# EAGLE schematic Arduino_MEGA2560_ref (EAGLE 9.6.2)
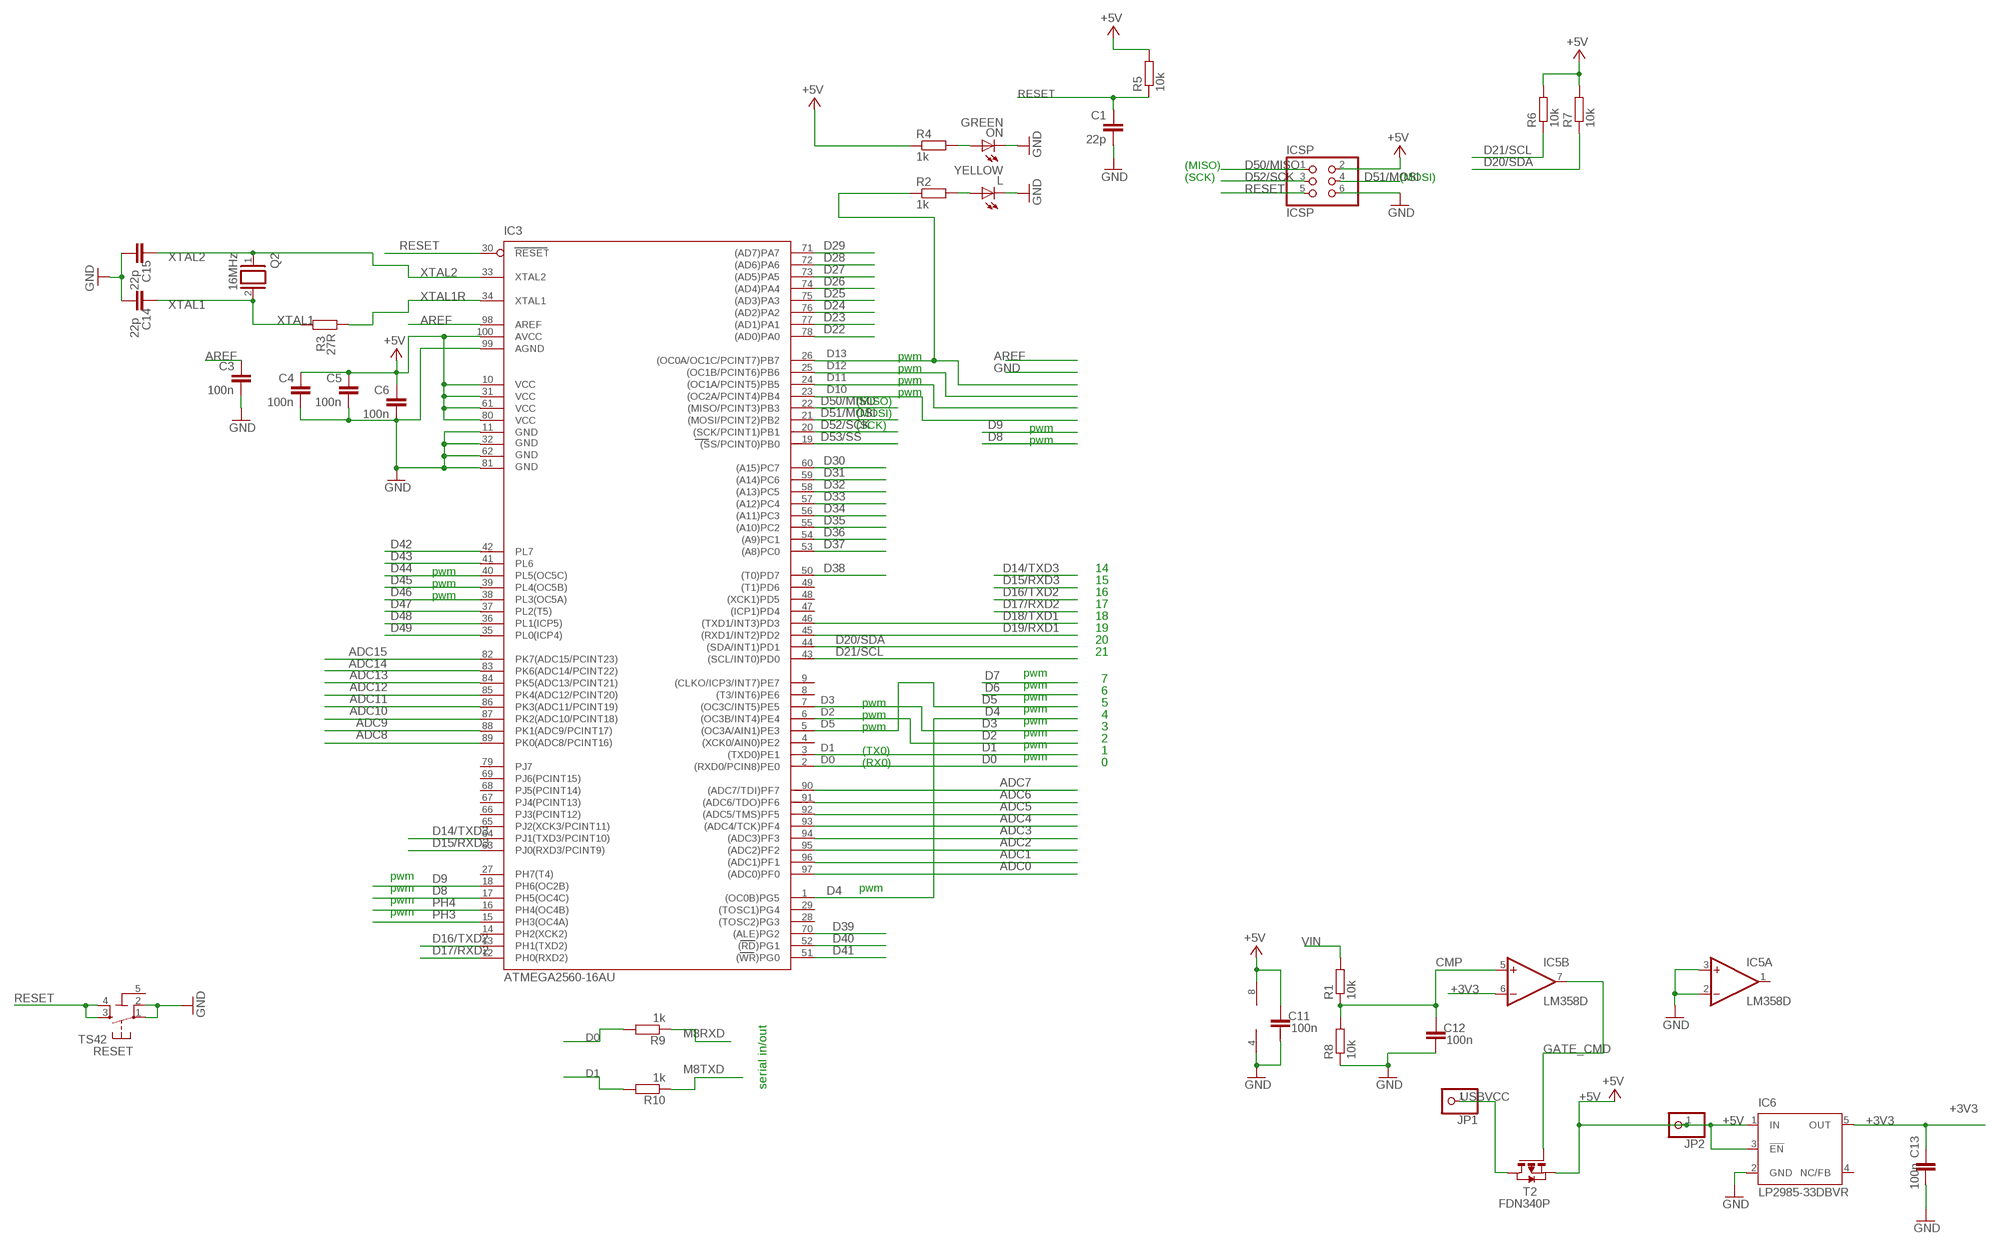
[diagram p0: schematic, sheet 1]

## Parts
C1  22p  C-EU0603-RND  [C0603-ROUND]
C3  100n  C-EU0603-RND  [C0603-ROUND]
C4  100n  C-EU0603-RND  [C0603-ROUND]
C5  100n  C-EU0603-RND  [C0603-ROUND]
C6  100n  C-EU0603-RND  [C0603-ROUND]
C11  100n  C-EUC0603  [C0603]
C12  100n  C-EU0603-RND  [C0603-ROUND]
C13  100n  C-EU0603-RND  [C0603-ROUND]
C14  22p  C-EU0603-RND  [C0603-ROUND]
C15  22p  C-EU0603-RND  [C0603-ROUND]
IC3  ATMEGA2560-16AU  ATMEGA1280-16AU  [TQFP100]
IC5  LM358D  [SO08]
IC6  LP2985-33DBVR  TPS77033  [SOT23-DBV]
ICSP  ICSP  PINHD-2X3  [2X03]
JP1  PINHD-1X1  [1X01]
JP2  PINHD-1X1  [1X01]
L  YELLOW  LEDCHIP-LED0805  [CHIP-LED0805]
ON  GREEN  LEDCHIP-LED0805  [CHIP-LED0805]
Q2  16MHz  XTAL/S  [QS]
R1  10k  R-EU_R0603  [R0603]
R2  1k  R-EU_R0603  [R0603]
R3  27R  R-EU_R0603  [R0603-ROUND]
R4  1k  R-EU_R0603  [R0603]
R5  10k  R-EU_R0603  [R0603]
R6  10k  R-EU_R0603  [R0603]
R7  10k  R-EU_R0603  [R0603]
R8  10k  R-EU_R0603  [R0603]
R9  1k  R-EU_R0603  [R0603]
R10  1k  R-EU_R0603  [R0603]
RESET  TS42  [TS42]
T2  FDN340P  PMOSSOT23  [SOT-23]

## Nets
+3V3: C13.2 IC5.6(B:-IN) IC6.5(OUT)
+5V: C4.1 C5.1 C6.1 C11.2 IC3.10(VCC) IC3.31(VCC1) IC3.61(VCC2) IC3.80(VCC3) IC3.100(AVCC) IC5.8(P:V+) IC6.1(IN) IC6.3(!EN) ICSP.2 JP2.1 R4.1 R5.2 R6.2 R7.2 T2.2(S)
ADC0: IC3.97((ADC0)PF0)
ADC1: IC3.96((ADC1)PF1)
ADC2: IC3.95((ADC2)PF2)
ADC3: IC3.94((ADC3)PF3)
ADC4: IC3.93((ADC4/TCK)PF4)
ADC5: IC3.92((ADC5/TMS)PF5)
ADC6: IC3.91((ADC6/TDO)PF6)
ADC7: IC3.90((ADC7/TDI)PF7)
ADC8: IC3.89(PK0(ADC8/PCINT16))
ADC9: IC3.88(PK1(ADC9/PCINT17))
ADC10: IC3.87(PK2(ADC10/PCINT18))
ADC11: IC3.86(PK3(ADC11/PCINT19))
ADC12: IC3.85(PK4(ADC12/PCINT20))
ADC13: IC3.84(PK5(ADC13/PCINT21))
ADC14: IC3.83(PK6(ADC14/PCINT22))
ADC15: IC3.82(PK7(ADC15/PCINT23))
AREF: C3.1 IC3.98(AREF)
CMP: C12.2 IC5.5(B:+IN) R1.1 R8.2
D0: IC3.2((RXD0/PCIN8)PE0) R9.2
D1: IC3.3((TXD0)PE1) R10.2
D2: IC3.6((OC3B/INT4)PE4)
D3: IC3.7((OC3C/INT5)PE5)
D4: IC3.1((OC0B)PG5)
D5: IC3.5((OC3A/AIN1)PE3)
D8: IC3.17(PH5(OC4C))
D9: IC3.18(PH6(OC2B))
D10: IC3.23((OC2A/PCINT4)PB4)
D11: IC3.24((OC1A/PCINT5)PB5)
D12: IC3.25((OC1B/PCINT6)PB6)
D13: IC3.26((OC0A/OC1C/PCINT7)PB7) R2.1
D14/TXD3: IC3.64(PJ1(TXD3/PCINT10))
D15/RXD3: IC3.63(PJ0(RXD3/PCINT9))
D16/TXD2: IC3.13(PH1(TXD2))
D17/RXD2: IC3.12(PH0(RXD2))
D18/TXD1: IC3.46((TXD1/INT3)PD3)
D19/RXD1: IC3.45((RXD1/INT2)PD2)
D20/SDA: IC3.44((SDA/INT1)PD1) R7.1
D21/SCL: IC3.43((SCL/INT0)PD0) R6.1
D22: IC3.78((AD0)PA0)
D23: IC3.77((AD1)PA1)
D24: IC3.76((AD2)PA2)
D25: IC3.75((AD3)PA3)
D26: IC3.74((AD4)PA4)
D27: IC3.73((AD5)PA5)
D28: IC3.72((AD6)PA6)
D29: IC3.71((AD7)PA7)
D30: IC3.60((A15)PC7)
D31: IC3.59((A14)PC6)
D32: IC3.58((A13)PC5)
D33: IC3.57((A12)PC4)
D34: IC3.56((A11)PC3)
D35: IC3.55((A10)PC2)
D36: IC3.54((A9)PC1)
D37: IC3.53((A8)PC0)
D38: IC3.50((T0)PD7)
D39: IC3.70((ALE)PG2)
D40: IC3.52((RD)PG1)
D41: IC3.51((WR)PG0)
D42: IC3.42(PL7)
D43: IC3.41(PL6)
D44: IC3.40(PL5(OC5C))
D45: IC3.39(PL4(OC5B))
D46: IC3.38(PL3(OC5A))
D47: IC3.37(PL2(T5))
D48: IC3.36(PL1(ICP5))
D49: IC3.35(PL0(ICP4))
D50/MISO: IC3.22((MISO/PCINT3)PB3) ICSP.1
D51/MOSI: IC3.21((MOSI/PCINT2)PB2) ICSP.4
D52/SCK: IC3.20((SCK/PCINT1)PB1) ICSP.3
D53/SS: IC3.19((SS/PCINT0)PB0)
GATE_CMD: IC5.7(B:OUT) T2.3(G)
GND: C1.2 C3.2 C4.2 C5.2 C6.2 C11.1 C12.1 C13.1 C14.1 C15.1 IC3.11(GND) IC3.32(GND1) IC3.62(GND2) IC3.81(GND3) IC3.99(AGND) IC5.2(A:-IN) IC5.3(A:+IN) IC5.4(P:V-) IC6.2(GND) ICSP.6 L.C ON.C R8.1 RESET.1 RESET.2
M8RXD: R9.1
M8TXD: R10.1
N$2: L.A R2.2
N$3: ON.A R4.2
PH3: IC3.15(PH3(OC4A))
PH4: IC3.16(PH4(OC4B))
RESET: C1.1 IC3.30(RESET) ICSP.5 R5.1 RESET.3 RESET.4
USBVCC: JP1.1 T2.1(D)
VIN: R1.2
XTAL1: C14.2 Q2.2 R3.2
XTAL1R: IC3.34(XTAL1) R3.1
XTAL2: C15.2 IC3.33(XTAL2) Q2.1
Unconnected: IC3.4((XCK0/AIN0)PE2) IC3.8((T3/INT6)PE6) IC3.9((CLKO/ICP3/INT7)PE7) IC3.14(PH2(XCK2)) IC3.27(PH7(T4)) IC3.28((TOSC2)PG3) IC3.29((TOSC1)PG4) IC3.47((ICP1)PD4) IC3.48((XCK1)PD5) IC3.49((T1)PD6) IC3.65(PJ2(XCK3/PCINT11)) IC3.66(PJ3(PCINT12)) IC3.67(PJ4(PCINT13)) IC3.68(PJ5(PCINT14)) IC3.69(PJ6(PCINT15)) IC3.79(PJ7) IC5.1(A:OUT) IC6.4(NC/FB)

## Notes on the sheet
- (MISO)
- (SCK) | (MOSI)
- pwm
- pwm
- pwm
- pwm
- (MISO)
- (MOSI)
- (SCK) | pwm
- pwm
- pwm | 14
- pwm | 15
- pwm | 16
- 17
- 18
- 19
- 20
- 21
- pwm
- 7
- pwm
- 6
- pwm
- pwm | 5
- pwm
- pwm | 4
- pwm
- pwm | 3
- pwm
- 2
- pwm
- (TX0) | 1
- pwm
- (RX0) | 0
- pwm
- pwm | pwm
- pwm
- pwm
- serial in/out

## Power pins joined to a net without a drawn wire
5-GND: RESET.5(5-GND)

## Library data of the parts
C1 C3-C6 C12-C15 = SmartPrj:C-EU: CAPACITOR, European symbol
C11 = rcl:C-EU: CAPACITOR, European symbol
IC3 = atmel-2005:ATMEGA*: MICROCONTROLLER 64/128/256 Kbytes FLASH 4 Kbytes EEPROM 8 Kbytes SRAM 86 General Purpose I/O pins 12-channels16-bit PWM 4 x Serial USARTs 16-channels 10-bit A/D
IC5 = linear:LM358: OP AMP also LM158; LM258; LM2904 Source: http://cache.national.com/ds/LM/LM158.pdf
IC6 = texas:TPS770*: ULTRALOW-POWER 50-mA LOW-DROPOUT LINEAR REGULATORS 50-mA Low-Dropout Regulator Source: http://focus.ti.com/lit/ds/symlink/tps77001.pdf
ICSP = pinhead:PINHD-2X3: PIN HEADER
JP1 JP2 = pinhead:PINHD-1X1: PIN HEADER
L ON = led:LED: LED OSRAM: - CHIPLED LG R971, LG N971, LY N971, LG Q971, LY Q971, LO R971, LY R971 LH N974, LH R974 LS Q976, LO Q976, LY Q976 LO Q996 - Hyper CHIPLED LW Q18S LB Q993, LB Q99A, LB R99A - SideLED LS A670, LO A670, LY A670, LG A670, LP A670 LB A673, LV A673, LT A673, LW A673 LH A674 LY A675 LS A676, LA A676, LO A676, LY A676, LW A676 LS A679, LY A679, LG A679 - Hyper Micro SIDELED® LS Y876, LA Y876, LO Y876, LY Y876 LT Y87S - SmartLED LW L88C, LW L88S LB L89C, LB L89S, LG L890 LS L89K, LO L89K, LY L89K LS L896, LA L896, LO L896, LY L896 - TOPLED LS T670, LO T670, LY T670, LG T670, LP T670 LSG T670, LSP T670, LSY T670, LOP T670, LYG T670 LG T671, LOG T671, LSG T671 LB T673, LV T673, LT T673, LW T673 LH T674 LS T676, LA T676, LO T676, LY T676, LB T676, LH T676, LSB T676, LW T676 LB T67C, LV T67C, LT T67C, LS T67K, LO T67K, LY T67K, LW E67C LS E67B, LA E67B, LO E67B, LY E67B, LB E67C, LV E67C, LT E67C LW T67C LS T679, LY T679, LG T679 LS T770, LO T770, LY T770, LG T770, LP T770 LB T773, LV T773, LT T773, LW T773 LH T774 LS E675, LA E675, LY E675, LS T675 LS T776, LA T776, LO T776, LY T776, LB T776 LHGB T686 LT T68C, LB T68C - Hyper Mini TOPLED® LB M676 - Mini TOPLED Santana® LG M470 LS M47K, LO M47K, LY M47K Source: http://www.osram.convergy.de LUXEON: - LUMILED® LXK2-PW12-R00, LXK2-PW12-S00, LXK2-PW14-U00, LXK2-PW14-V00 LXK2-PM12-R00, LXK2-PM12-S00, LXK2-PM14-U00 LXK2-PE12-Q00, LXK2-PE12-R00, LXK2-PE12-S00, LXK2-PE14-T00, LXK2-PE14-U00 LXK2-PB12-K00, LXK2-PB12-L00, LXK2-PB12-M00, LXK2-PB14-N00, LXK2-PB14-P00, LXK2-PB14-Q00 LXK2-PR12-L00, LXK2-PR12-M00, LXK2-PR14-Q00, LXK2-PR14-R00 LXK2-PD12-Q00, LXK2-PD12-R00, LXK2-PD12-S00 LXK2-PH12-R00, LXK2-PH12-S00 LXK2-PL12-P00, LXK2-PL12-Q00, LXK2-PL12-R00 Source: www.luxeon.com KINGBRIGHT: KA-3528ASYC Source: www.kingbright.com
Q2 = special:XTAL/S: CRYSTAL
R1 R2 R4-R10 = rcl:R-EU_: RESISTOR, European symbol; SPICEPREFIX: R
R3 = SmartPrj:R-EU_: RESISTOR, European symbol
RESET = st-mod v1.4:TS42: TS42 Dongnan Electronics Tact switch VDC 12V - 50mA
T2 = zetex:PMOSSOT23: MOS FET

## Net classes
0 default: width 0.152 mm, drill 0.305 mm, clearance 0.152 mm